# Altium schematic sheet sch.SchDoc
size 127 x 127 mm
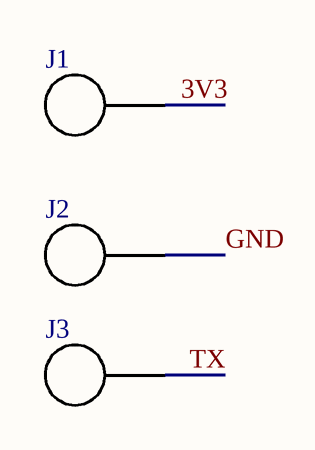
[diagram p0: sch.SchDoc]

## Parts
J1  pad single  [PAD_SING]  (value not drawn)
J2  pad single  [PAD_SING]  (value not drawn)
J3  pad single  [PAD_SING]  (value not drawn)

## Nets
3V3: J1.1
GND: J2.1
TX: J3.1

## Library data of the parts
J1-J3 = PAD-SING